# EAGLE schematic AVS-Controller (EAGLE 6.3)

## Sheet 1 of 3: CPU
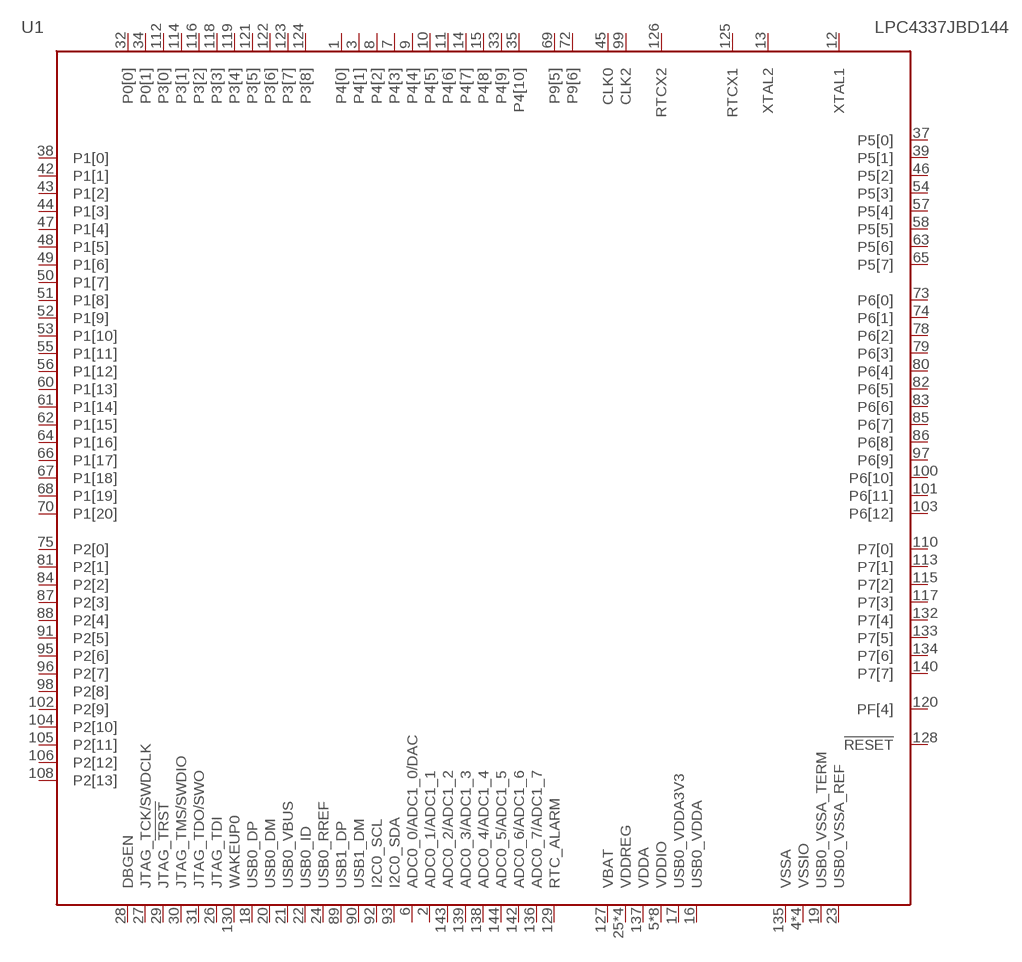
[diagram p0: schematic, sheet 1]

### Parts
U1  LPC4337JBD144  [SOT486-1]
Unconnected: U1.1(P4[0]) U1.2(ADC0_1/ADC1_1) U1.3(P4[1]) U1.6(ADC0_0/ADC1_0/DAC) U1.7(P4[3]) U1.8(P4[2]) U1.9(P4[4]) U1.10(P4[5]) U1.11(P4[6]) U1.12(XTAL1) U1.13(XTAL2) U1.14(P4[7]) U1.15(P4[8]) U1.18(USB0_DP) U1.20(USB0_DM) U1.21(USB0_VBUS) U1.22(USB0_ID) U1.24(USB0_RREF) U1.26(JTAG_TDI) U1.27(JTAG_TCK/SWDCLK) U1.28(DBGEN) U1.29(JTAG_!TRST) U1.30(JTAG_TMS/SWDIO) U1.31(JTAG_TDO/SWO) U1.32(P0[0]) U1.33(P4[9]) U1.34(P0[1]) U1.35(P4[10]) U1.37(P5[0]) U1.38(P1[0]) U1.39(P5[1]) U1.42(P1[1]) U1.43(P1[2]) U1.44(P1[3]) U1.45(CLK0) U1.46(P5[2]) U1.47(P1[4]) U1.48(P1[5]) U1.49(P1[6]) U1.50(P1[7]) U1.51(P1[8]) U1.52(P1[9]) U1.53(P1[10]) U1.54(P5[3]) U1.55(P1[11]) U1.56(P1[12]) U1.57(P5[4]) U1.58(P5[5]) U1.60(P1[13]) U1.61(P1[14]) U1.62(P1[15]) U1.63(P5[6]) U1.64(P1[16]) U1.65(P5[7]) U1.66(P1[17]) U1.67(P1[18]) U1.68(P1[19]) U1.69(P9[5]) U1.70(P1[20]) U1.72(P9[6]) U1.73(P6[0]) U1.74(P6[1]) U1.75(P2[0]) U1.78(P6[2]) U1.79(P6[3]) U1.80(P6[4]) U1.81(P2[1]) U1.82(P6[5]) U1.83(P6[6]) U1.84(P2[2]) U1.85(P6[7]) U1.86(P6[8]) U1.87(P2[3]) U1.88(P2[4]) U1.89(USB1_DP) U1.90(USB1_DM) U1.91(P2[5]) U1.92(I2C0_SCL) U1.93(I2C0_SDA) U1.95(P2[6]) U1.96(P2[7]) U1.97(P6[9]) U1.98(P2[8]) U1.99(CLK2) U1.100(P6[10]) U1.101(P6[11]) U1.102(P2[9]) U1.103(P6[12]) U1.104(P2[10]) U1.105(P2[11]) U1.106(P2[12]) U1.108(P2[13]) U1.110(P7[0]) U1.112(P3[0]) U1.113(P7[1]) U1.114(P3[1]) U1.115(P7[2]) U1.116(P3[2]) U1.117(P7[3]) U1.118(P3[3]) U1.119(P3[4]) U1.120(PF[4]) U1.121(P3[5]) U1.122(P3[6]) U1.123(P3[7]) U1.124(P3[8]) U1.125(RTCX1) U1.126(RTCX2) U1.128(!RESET!) U1.129(RTC_ALARM) U1.130(WAKEUP0) U1.132(P7[4]) U1.133(P7[5]) U1.134(P7[6]) U1.136(ADC0_7/ADC1_7) U1.138(ADC0_4/ADC1_4) U1.139(ADC0_3/ADC1_3) U1.140(P7[7]) U1.142(ADC0_6/ADC1_6) U1.143(ADC0_2/ADC1_2) U1.144(ADC0_5/ADC1_5)

## Sheet 2 of 3: AVS I/O
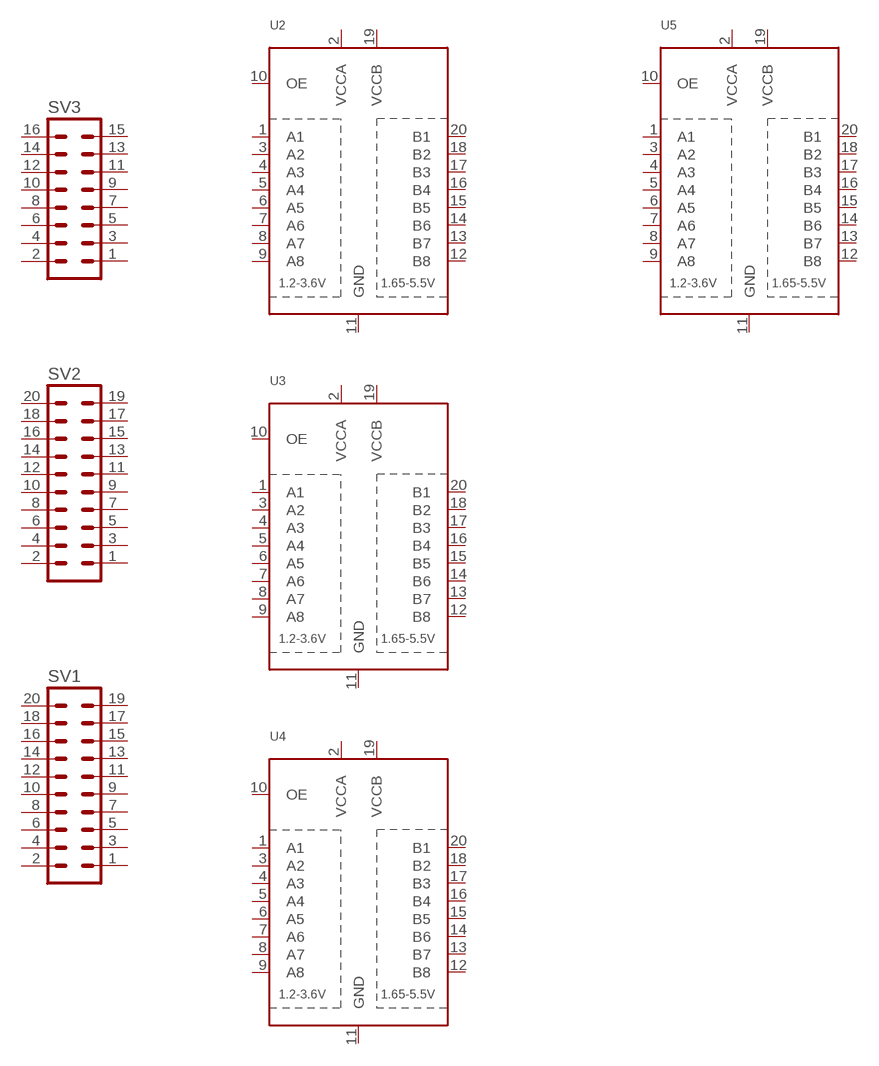
[diagram p1: schematic, sheet 2]

### Parts
SV1  MA10-2  [MA10-2]
SV2  MA10-2  [MA10-2]
SV3  MA08-2  [MA08-2]
U2  TXB0108PWR  [TSSOP20]
U3  TXB0108PWR  [TSSOP20]
U4  TXB0108PWR  [TSSOP20]
U5  TXB0108PWR  [TSSOP20]
Unconnected: SV1.1 SV1.2 SV1.3 SV1.4 SV1.5 SV1.6 SV1.7 SV1.8 SV1.9 SV1.10 SV1.11 SV1.12 SV1.13 SV1.14 SV1.15 SV1.16 SV1.17 SV1.18 SV1.19 SV1.20 SV2.1 SV2.2 SV2.3 SV2.4 SV2.5 SV2.6 SV2.7 SV2.8 SV2.9 SV2.10 SV2.11 SV2.12 SV2.13 SV2.14 SV2.15 SV2.16 SV2.17 SV2.18 SV2.19 SV2.20 SV3.1 SV3.2 SV3.3 SV3.4 SV3.5 SV3.6 SV3.7 SV3.8 SV3.9 SV3.10 SV3.11 SV3.12 SV3.13 SV3.14 SV3.15 SV3.16 U2.1(A1) U2.2(VCCA) U2.3(A2) U2.4(A3) U2.5(A4) U2.6(A5) U2.7(A6) U2.8(A7) U2.9(A8) U2.10(OE) U2.11(GND) U2.12(B8) U2.13(B7) U2.14(B6) U2.15(B5) U2.16(B4) U2.17(B3) U2.18(B2) U2.19(VCCB) U2.20(B1) U3.1(A1) U3.2(VCCA) U3.3(A2) U3.4(A3) U3.5(A4) U3.6(A5) U3.7(A6) U3.8(A7) U3.9(A8) U3.10(OE) U3.11(GND) U3.12(B8) U3.13(B7) U3.14(B6) U3.15(B5) U3.16(B4) U3.17(B3) U3.18(B2) U3.19(VCCB) U3.20(B1) U4.1(A1) U4.2(VCCA) U4.3(A2) U4.4(A3) U4.5(A4) U4.6(A5) U4.7(A6) U4.8(A7) U4.9(A8) U4.10(OE) U4.11(GND) U4.12(B8) U4.13(B7) U4.14(B6) U4.15(B5) U4.16(B4) U4.17(B3) U4.18(B2) U4.19(VCCB) U4.20(B1) U5.1(A1) U5.2(VCCA) U5.3(A2) U5.4(A3) U5.5(A4) U5.6(A5) U5.7(A6) U5.8(A7) U5.9(A8) U5.10(OE) U5.11(GND) U5.12(B8) U5.13(B7) U5.14(B6) U5.15(B5) U5.16(B4) U5.17(B3) U5.18(B2) U5.19(VCCB) U5.20(B1)

## Sheet 3 of 3: USB
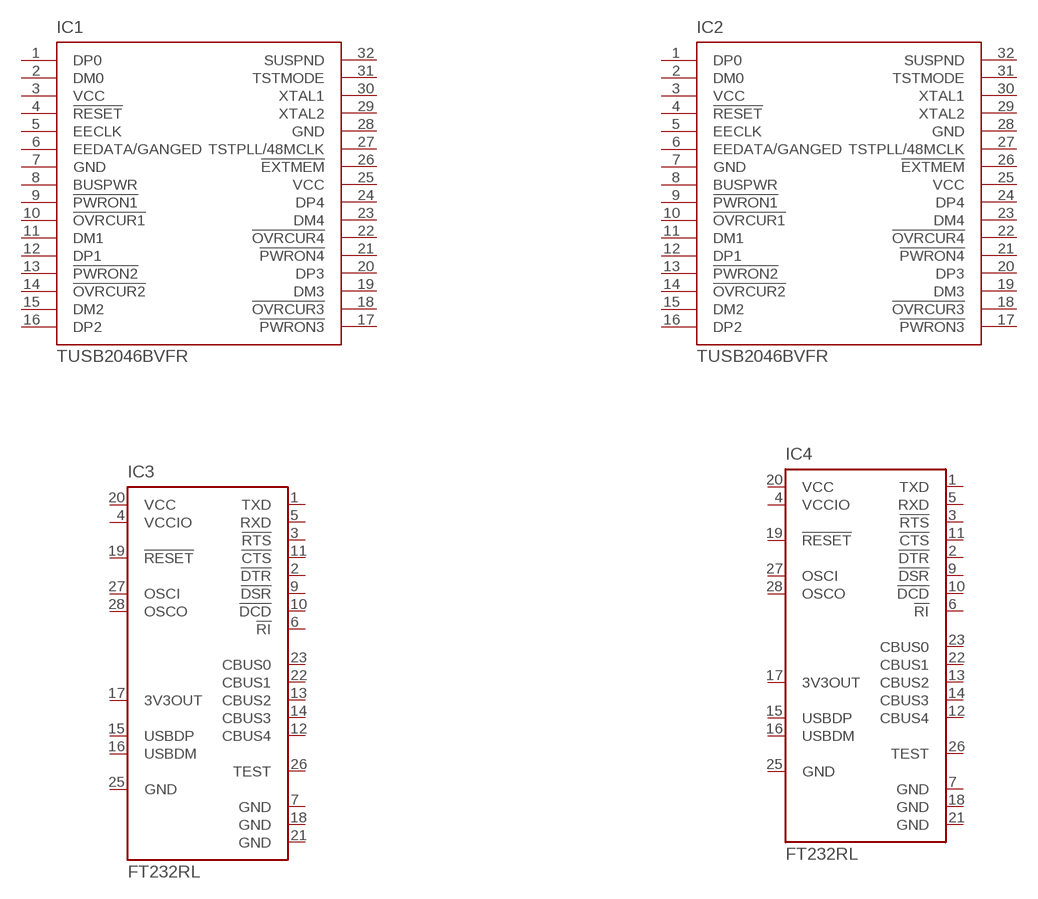
[diagram p2: schematic, sheet 3]

### Parts
IC1  TUSB2046BVFR  [VF_S-PQFP-G32]
IC2  TUSB2046BVFR  [VF_S-PQFP-G32]
IC3  FT232RL  [SSOP28]
IC4  FT232RL  [SSOP28]
Unconnected: IC1.1(DP0) IC1.2(DM0) IC1.4(!RESET) IC1.5(EECLK) IC1.6(EEDATA/GANGED) IC1.8(BUSPWR) IC1.9(!PWRON1) IC1.10(!OVRCUR1) IC1.11(DM1) IC1.12(DP1) IC1.13(!PWRON2) IC1.14(!OVRCUR2) IC1.15(DM2) IC1.16(DP2) IC1.17(!PWRON3) IC1.18(!OVRCUR3) IC1.19(DM3) IC1.20(DP3) IC1.21(!PWRON4) IC1.22(!OVRCUR4) IC1.23(DM4) IC1.24(DP4) IC1.26(!EXTMEM) IC1.27(TSTPLL/48MCLK) IC1.29(XTAL2) IC1.30(XTAL1) IC1.31(TSTMODE) IC1.32(SUSPND) IC2.1(DP0) IC2.2(DM0) IC2.4(!RESET) IC2.5(EECLK) IC2.6(EEDATA/GANGED) IC2.8(BUSPWR) IC2.9(!PWRON1) IC2.10(!OVRCUR1) IC2.11(DM1) IC2.12(DP1) IC2.13(!PWRON2) IC2.14(!OVRCUR2) IC2.15(DM2) IC2.16(DP2) IC2.17(!PWRON3) IC2.18(!OVRCUR3) IC2.19(DM3) IC2.20(DP3) IC2.21(!PWRON4) IC2.22(!OVRCUR4) IC2.23(DM4) IC2.24(DP4) IC2.26(!EXTMEM) IC2.27(TSTPLL/48MCLK) IC2.29(XTAL2) IC2.30(XTAL1) IC2.31(TSTMODE) IC2.32(SUSPND) IC3.1(TXD) IC3.2(!DTR) IC3.3(!RTS) IC3.5(RXD) IC3.6(!RI) IC3.9(!DSR) IC3.10(!DCD) IC3.11(!CTS) IC3.12(CBUS4) IC3.13(CBUS2) IC3.14(CBUS3) IC3.15(USBDP) IC3.16(USBDM) IC3.17(3V3OUT) IC3.19(!RESET) IC3.22(CBUS1) IC3.23(CBUS0) IC3.26(TEST) IC3.27(OSCI) IC3.28(OSCO) IC4.1(TXD) IC4.2(!DTR) IC4.3(!RTS) IC4.5(RXD) IC4.6(!RI) IC4.9(!DSR) IC4.10(!DCD) IC4.11(!CTS) IC4.12(CBUS4) IC4.13(CBUS2) IC4.14(CBUS3) IC4.15(USBDP) IC4.16(USBDM) IC4.17(3V3OUT) IC4.19(!RESET) IC4.22(CBUS1) IC4.23(CBUS0) IC4.26(TEST) IC4.27(OSCI) IC4.28(OSCO)

## Power pins joined to a net without a drawn wire
GND: IC1.7(GND) IC1.28(GND) IC2.7(GND) IC2.28(GND) IC3.7(GND) IC3.18(GND) IC3.21(GND) IC3.25(GND) IC4.7(GND) IC4.18(GND) IC4.21(GND) IC4.25(GND)
USB0_VDDA: U1.16(USB0_VDDA)
USB0_VDDA3V3: U1.17(USB0_VDDA3V3)
USB0_VSSA_REF: U1.23(USB0_VSSA_REF)
USB0_VSSA_TERM: U1.19(USB0_VSSA_TERM)
VBAT: U1.127(VBAT)
VCC: IC1.3(VCC) IC1.25(VCC) IC2.3(VCC) IC2.25(VCC) IC3.20(VCC) IC4.20(VCC)
VCCIO: IC3.4(VCCIO) IC4.4(VCCIO)
VDDA: U1.137(VDDA)
VDDIO: U1.5(VDDIO) U1.36(VDDIO) U1.41(VDDIO) U1.71(VDDIO) U1.77(VDDIO) U1.107(VDDIO) U1.111(VDDIO) U1.141(VDDIO)
VDDREG: U1.25(VDDREG) U1.59(VDDREG) U1.94(VDDREG) U1.131(VDDREG)
VSSA: U1.135(VSSA)
VSSIO: U1.4(VSSIO) U1.40(VSSIO) U1.76(VSSIO) U1.109(VSSIO)

## Library data of the parts
IC1 IC2 = texas:TUSB2046B: 4-PORT HUB FOR THE UNIVERSAL SERIAL BUS WITH OPTIONAL SERIAL EEPROM INTERFACE Auto generated by make-symbol-device-package-bsdl.ulp Rev. 30 Source: http://focus.ti.com/lit/ds/symlink/tusb2046b.pdf; MF: TEXAS INSTRUMENTS; MPN: TUSB2046BVFR; OC_FARNELL: 1470507; OC_NEWARK: 77C1806
IC3 IC4 = ftdichip:FT232R: Source: http://www.ftdichip.com/Documents/DataSheets/DS_FT232R_v104.pdf; MPN: FT232RL; OC_FARNELL: 1146032; OC_NEWARK: 91K9918
SV1 SV2 = con-lstb:MA10-2: PIN HEADER; OC_FARNELL: unknown; OC_NEWARK: unknown
SV3 = con-lstb:MA08-2: PIN HEADER; OC_FARNELL: unknown; OC_NEWARK: unknown
U1 = nxp_60_1_1:LPC4337JBD144: 32-bit ARM Cortex-M4/M0 MCU; up to 1 MB flash and 136 kB SRAM; Ethernet, two High-speed USB, LCD, EMC The LPC435x/3x/2x/1x are ARM Cortex-M4 based microcontrollers for embedded applications which include an ARM Cortex-M0 coprocessor, up to 1 MB of flash and 136 kB of on-chip SRAM, 16 kB of EEPROM memory, a quad SPI Flash Interface (SPIFI), advanced configurable peripherals such as the State Configurable Timer (SCT) and the Serial General Purpose I/O (SGPIO) interface, two High-speed USB controllers, Ethernet, LCD, an external memory controller, and multiple digital and analog peripherals. The LPC435x/3x/2x/1x operate at CPU frequencies of up to 204 MHz. The ARM Cortex-M4 is a next generation 32-bit core that offers system enhancements such as low power consumption, enhanced debug features, and a high level of support block integration. The ARM Cortex-M4 CPU incorporates a 3-stage pipeline, uses a Harvard architecture with separate local instruction and data buses as well as a third bus for peripherals, and includes an internal prefetch unit that supports speculative branching. The ARM Cortex-M4 supports single-cycle digital signal processing and SIMD instructions. A hardware floating-point unit is integrated in the core. The ARM Cortex-M0 coprocessor is an energy-efficient and easy-to-use 32-bit core which is upward code- and tool-compatible with the Cortex-M4 core. The Cortex-M0 coprocessor, designed as a replacement for existing 8/16-bit microcontrollers, offers up to 204 MHz performance with a simple instruction set and reduced code size. AAL Eindhoven MK
U2-U5 = adafruit:TXB0108PWR: 8-Bit Bi-Directional Level Shifter 1.2V-3.6V (VCCA) to 1.65V-5.5V (VCCB) bi-directional level shifter with auto direction sensing. Max data rate - VCCA 1.8V: 20Mbps (50ns), VCCA 3.3V: 100Mbps (10ns) Digikey: 296-21527-1-ND